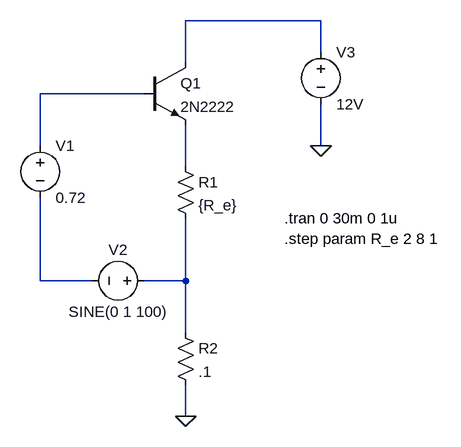
[diagram p0: schematic class_AB_subsystem_source.asc]
class_AB_subsystem_source.asc, the LTspice schematic file:
Version 4
SHEET 1 920 692
WIRE 464 64 256 64
WIRE 464 112 464 64
WIRE 256 128 256 64
WIRE 192 176 32 176
WIRE 32 256 32 176
WIRE 464 256 464 192
WIRE 256 288 256 224
WIRE 32 464 32 336
WIRE 112 464 32 464
WIRE 256 464 256 368
WIRE 256 464 192 464
WIRE 256 544 256 464
WIRE 256 672 256 624
FLAG 256 672 0
FLAG 464 256 0
SYMBOL npn3 192 128 R0
SYMATTR InstName Q1
SYMATTR Value 2N2222
SYMBOL res 240 272 R0
SYMATTR InstName R1
SYMATTR Value {R_e}
SYMBOL voltage 32 240 R0
WINDOW 123 0 0 Left 0
WINDOW 39 0 0 Left 0
SYMATTR InstName V1
SYMATTR Value 0.72
SYMBOL voltage 208 464 R90
WINDOW 0 -32 56 VBottom 2
WINDOW 3 32 56 VTop 2
WINDOW 123 0 0 Left 0
WINDOW 39 0 0 Left 0
SYMATTR InstName V2
SYMATTR Value SINE(0 1 100)
SYMBOL voltage 464 96 R0
WINDOW 123 0 0 Left 0
WINDOW 39 0 0 Left 0
SYMATTR InstName V3
SYMATTR Value 12V
SYMBOL res 240 528 R0
SYMATTR InstName R2
SYMATTR Value .1
TEXT 408 368 Left 2 !.tran 0 30m 0 1u\n.step param R_e 2 8 1

The netlist it stands for:
* class_AB_subsystem_source.asc
Q1 N001 N002 N003 0 2N2222
R1 N003 N005 {R_e}
V1 N002 N004 0.72
V2 N005 N004 SINE(0 1 100)
V3 N001 0 12V
R2 N005 0 .1
.model NPN NPN
.model PNP PNP
.lib standard.bjt
.tran 0 30m 0 1u
.step param R_e 2 8 1
.backanno
.end